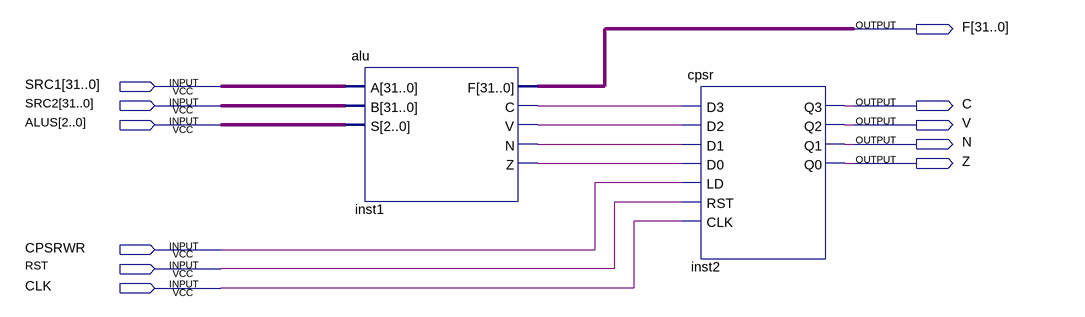
[diagram p0: schematic sheet]
// Quartus schematic execute.bdf as structural Verilog: 2 symbols, 11 pins
module execute (
  input  [31:0] SRC1,
  input  [31:0] SRC2,
  input  [2:0] ALUS,
  input  CPSRWR,
  input  RST,
  input  CLK,
  output [31:0] F,
  output C,
  output V,
  output N,
  output Z
);

  wire inst1_c, inst1_n, inst1_v, inst1_z;

  alu inst1 (.A(SRC1), .B(SRC2), .S(ALUS), .F(F), .C(inst1_c), .V(inst1_v), .N(inst1_n), .Z(inst1_z));
  cpsr inst2 (
    .D3(inst1_c), .D2(inst1_v), .D1(inst1_n), .D0(inst1_z), .LD(CPSRWR), .RST(RST), .CLK(CLK), .Q3(C),
    .Q2(V), .Q1(N), .Q0(Z));
endmodule
